# Altium schematic sheet USB-C Power.SchDoc
size A4; SheetNumber: 2; SheetTotal: 2; SPICEModelCacheBOOBVADC: <root> / <DocumentId>BOOBVADC</DocumentId> / </root>
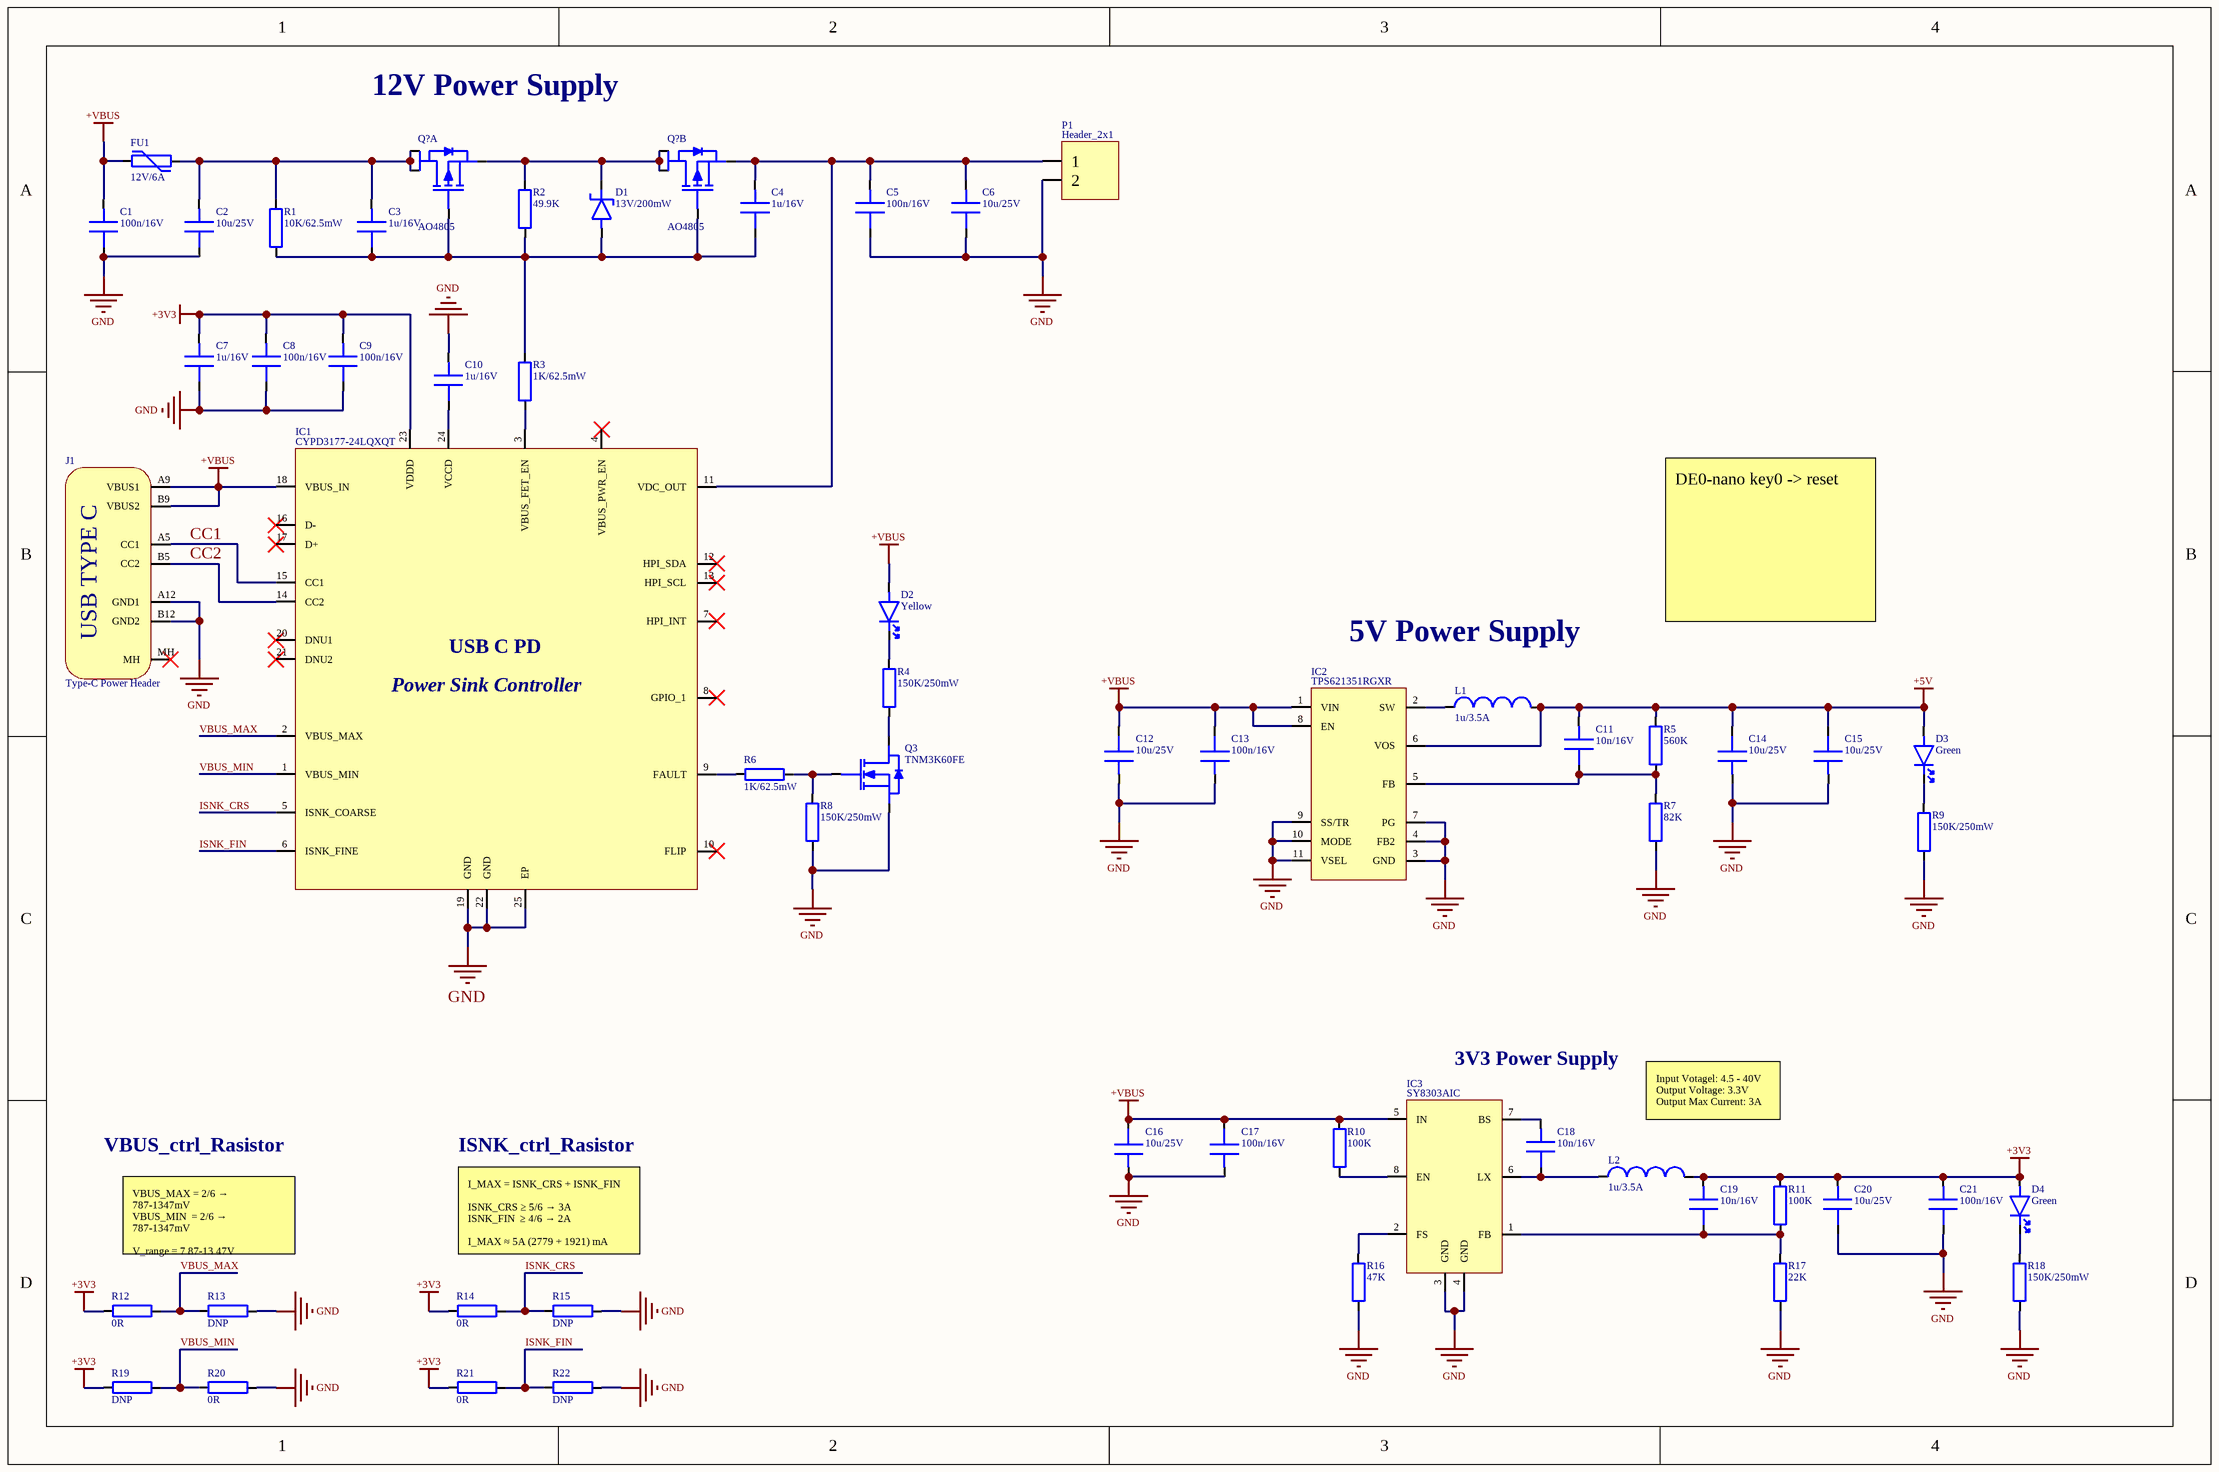
[diagram p0: USB-C Power.SchDoc]

## Parts
(Parts that share a designator on the sheet are numbered #1, #2 ... from top to bottom, then left to right.)
C1  100n/16V  [0805_Cap]
C2  10u/25V  [0805_Cap]
C3  1u/16V  [0805_Cap]
C4  1u/16V  [0805_Cap]
C5  100n/16V  [0805_Cap]
C6  10u/25V  [0805_Cap]
C7  1u/16V  [0805_Cap]
C8  100n/16V  [0805_Cap]
C9  100n/16V  [0805_Cap]
C10  1u/16V  [0805_Cap]
C11  10n/16V  [0805_Cap]
C12  10u/25V  [0805_Cap]
C13  100n/16V  [0805_Cap]
C14  10u/25V  [0805_Cap]
C15  10u/25V  [0805_Cap]
C16  10u/25V  [0805_Cap]
C17  100n/16V  [0805_Cap]
C18  10n/16V  [0805_Cap]
C19  10n/16V  [0805_Cap]
C20  10u/25V  [0805_Cap]
C21  100n/16V  [0805_Cap]
D1  13V/200mW  [SOD-523]
D2  Yellow  [0603_LED]
D3  Green  [0603_LED]
D4  Green  [0603_LED]
FU1  12V/6A  [1206_fuse]
IC1  CYPD3177-24LQXQT  [QFN-24]
IC2  TPS621351RGXR  [TSOT-23-8]
IC3  SY8303AIC
J1  Type-C Power Header  [1016435900011LF]
L1  1u/3.5A
L2  1u/3.5A
P1  Header_2x1
Q3  TNM3K60FE
Q?#1  AO4805  [SOIC-8]  (part A of 2)
Q?#2  AO4805  [SOIC-8]  (part B of 2)
R1  10K/62.5mW  [0603_Res]
R2  49.9K  [0603_Res]
R3  1K/62.5mW  [0603_Res]
R4  150K/250mW  [0603_Res]
R5  560K  [0603_Res]
R6  1K/62.5mW  [0603_Res]
R7  82K  [0603_Res]
R8  150K/250mW  [0603_Res]
R9  150K/250mW  [0603_Res]
R10  100K  [0603_Res]
R11  100K  [0603_Res]
R12  0R  [0603_Res]
R13  DNP  [0603_Res]
R14  0R  [0603_Res]
R15  DNP  [0603_Res]
R16  47K  [0603_Res]
R17  22K  [0603_Res]
R18  150K/250mW  [0603_Res]
R19  DNP  [0603_Res]
R20  0R  [0603_Res]
R21  0R  [0603_Res]
R22  DNP  [0603_Res]

## Nets
+3V3: C7.1 C8.1 C9.1 C19.1 C20.1 C21.1 D4.1(A) IC1.23(VDDD) L2.2 R11.1 R12.1 R14.1 R19.1 R21.1
+5V: C11.1 C14.2 C15.2 D3.1(A) IC2.6(VOS) L1.2 R5.1
+VBUS: C1.1 C12.2 C13.2 C16.2 C17.2 D2.1(A) FU1.1 IC1.18(VBUS_IN) IC2.1(VIN) IC2.8(EN) IC3.5(IN) J1.A9(VBUS1) J1.B9(VBUS2) R10.2
GND: C1.2 C2.2 C5.2 C6.2 C7.2 C8.2 C9.2 C10.1 C12.1 C13.1 C14.1 C15.1 C16.1 C17.1 C20.2 C21.2 IC1.19(GND) IC1.22(GND) IC1.25(EP) IC2.3(GND) IC2.4(FB2) IC2.7(PG) IC2.9(SS/TR) IC2.10(MODE) IC2.11(VSEL) IC3.3(GND) IC3.4(GND) J1.A12(GND1) J1.B12(GND2) P1.2 Q3.3(S) R7.2 R8.2 R9.1 R13.2 R15.2 R16.2 R17.2 R18.1 R20.2 R22.2
CC1: IC1.15(CC1) J1.A5(CC1)
CC2: IC1.14(CC2) J1.B5(CC2)
ISNK_CRS: IC1.5(ISNK_COARSE) R14.2 R15.1
ISNK_FIN: IC1.6(ISNK_FINE) R21.2 R22.1
VBUS_MAX: IC1.2(VBUS_MAX) R12.2 R13.1
VBUS_MIN: IC1.1(VBUS_MIN) R19.2 R20.1
NetC2_1: C2.1 C3.1 FU1.2 Q?#1.5(D1) Q?#1.6(D1) R1.2
NetC3_2: C3.2 C4.2 D1.1(A) Q?#1.4(G1) Q?#2.2(G2) R1.1 R2.1 R3.2
NetC4_1: C4.1 C5.1 C6.1 IC1.11(VDC_OUT) P1.1 Q?#2.1(S2)
NetC10_2: C10.2 IC1.24(VCCD)
NetC11_2: C11.2 IC2.5(FB) R5.2 R7.1
NetC18_1: C18.1 IC3.7(BS)
NetC18_2: C18.2 IC3.6(LX) L2.1
NetC19_2: C19.2 IC3.1(FB) R11.2 R17.1
NetD1_2: D1.2(K) Q?#1.3(S1) Q?#2.7(D2) Q?#2.8(D2) R2.2
NetD2_2: D2.2(K) R4.2
NetD3_2: D3.2(K) R9.2
NetD4_2: D4.2(K) R18.2
NetIC1_3: IC1.3(VBUS_FET_EN) R3.1
NetIC1_9: IC1.9(FAULT) R6.1
NetIC2_2: IC2.2(SW) L1.1
NetIC3_2: IC3.2(FS) R16.1
NetIC3_8: IC3.8(EN) R10.1
NetQ3_1: Q3.1(D) R4.1
NetQ3_2: Q3.2(G) R6.2 R8.1

Not connected (* = marked no-connect by the designer): IC1 4(VBUS_PWR_EN)* 7(HPI_INT)* 8(GPIO_1)* 10(FLIP)* 12(HPI_SDA)* 13(HPI_SCL)* 16(D-)* 17(D+)* 20(DNU1)* 21(DNU2)*; J1 MH*

## Notes on the sheet
- (near Q?#1) 12V Power Supply
- DE0-nano key0 -> reset
- 5V Power Supply
- 3V3 Power Supply
- Input Votagel: 4.5 - 40V
  Output Voltage: 3.3V
  Output Max Current: 3A
- VBUS_ctrl_Rasistor
- ISNK_ctrl_Rasistor
- VBUS_MAX = 2/6 → 787-1347mV
  VBUS_MIN  = 2/6 → 787-1347mV
  V_range = 7.87-13.47V
- I_MAX = ISNK_CRS + ISNK_FIN
  ISNK_CRS ≥ 5/6 → 3A
  ISNK_FIN  ≥ 4/6 → 2A
  I_MAX ≈ 5A (2779 + 1921) mA
- (in symbol CYPD3177-24LQXQ) USB C PD; Power Sink Controller
- (in symbol Type-C_6_Female) USB TYPE C

## Library data of the parts
C1-C21 = Cap: General capacitor (non-polarized); Mfr. #: *; Mfr.: *; Datasheet: *; Distributor_Link: *; Distributor #: *
D1 = Diode_Zener: General zener diode; Mfr. #: *; Mfr.: *; Distributor_Link: *; Datasheet: *; Distributor #: *
D2-D4 = LED: General LED; Mfr. #: *; Mfr.: *; Distributor_Link: *; Datasheet: *; Distributor #: *
FU1 = Fuse: General fuse; Mfr. #: *; Mfr.: *; Distributor_Link: *; Datasheet: *; Distributor #: *
IC1 = CYPD3177-24LQXQ: USB Interface IC USB Type-C port controller CYPD3177; Mfr.: Infineon Technologies; Distributor_Link: https://www.mouser.tw/ProductDetail/727-CYPD3177-24LQXQT; Mfr. #: CYPD3177-24LQXQT; Datasheet: https://www.mouser.tw/datasheet/2/196/Infineon_EZ_PD_BCR_Datasheet_USB_Type_C_Port_Contr-3161917.pdf; Distributor #: 727-CYPD3177-24LQXQT
IC2 = TPS621351RGXR: Switching Voltage Regulators 3-17V 4.0A Step-Down Converter with 1% accuracy and PFM/Forced-PWM in 2x3QFN 11-VQFN-HR -40 to 125; Mfr.: Texas Instruments; Distributor_Link: https://jlcpcb.com/partdetail/TexasInstruments-TPS621351RGXR/C2070706; Mfr. #: TPS621351RGXR; Datasheet: https://www.ti.com/general/docs/suppproductinfo.tsp?distId=26&gotoUrl=https://www.ti.com/lit/gpn/tps62135; Distributor #: C2070706
IC3 = SY8303AIC: Step-down type TSOT-23-8 DC-DC Converters ROHS; Mfr.: Silergy Corp; Distributor_Link: https://www.mouser.tw/ProductDetail/727-CYPD3177-24LQXQT; Mfr. #: SY8303AIC; Datasheet: https://datasheet.lcsc.com/lcsc/1811151653_Silergy-Corp-SY8303AIC_C97054.pdf; Distributor #: C97054
J1 = Type-C_6_Female: Gerenal Type-C female header; MFR. #: *; Mfr.: *; Distributor_Link: *; Datasheet: *; Distributor #: *
L1 L2 = Inductor: General Inductor; Mfr. #: *; Mfr.: *; Distributor_Link: *; Datasheet: *; Distributor #: *
P1 = Header_2x1: General header 2x1; Mfr. #: *; Mfr.: *; Distributor_Link: *; Datasheet: *
Q3 = MOSFET_N: General n channel mosfet; Mfr. #: *; Mfr.: *; Distributor_Link: *; Datasheet: *; Distributor #: *
Q?#1 Q?#2 = MOSFET_P_2ch: General 2 Channel p mosfet; Mfr. #: *; Mfr.: *; Distributor_Link: *; Datasheet: *; Distributor #: *
R1-R22 = Res: General Resistor; Mfr. #: *; Mfr.: *; Distributor_Link: *; Datasheet: *; Distributor #: *